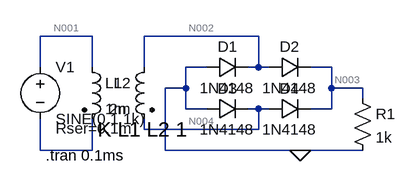
[diagram p0: schematic Draft6.asc]
Draft6.asc, the LTspice schematic file:
Version 4
SHEET 1 880 680
WIRE 0 32 -80 32
WIRE 256 32 80 32
WIRE -80 80 -80 32
WIRE 0 80 0 32
WIRE 80 80 80 32
WIRE 176 80 144 80
WIRE 256 80 256 32
WIRE 256 80 240 80
WIRE 272 80 256 80
WIRE 368 80 336 80
WIRE 144 112 144 80
WIRE 144 112 112 112
WIRE 368 112 368 80
WIRE 416 112 368 112
WIRE 416 128 416 112
WIRE 144 144 144 112
WIRE 176 144 144 144
WIRE 256 144 240 144
WIRE 272 144 256 144
WIRE 368 144 368 112
WIRE 368 144 336 144
WIRE 80 176 80 160
WIRE 256 176 256 144
WIRE 256 176 80 176
WIRE -80 208 -80 160
WIRE 0 208 0 160
WIRE 0 208 -80 208
WIRE 112 208 112 112
WIRE 320 208 112 208
WIRE 416 208 320 208
FLAG 320 208 0
SYMBOL diode 176 96 R270
WINDOW 0 32 32 VTop 2
WINDOW 3 0 32 VBottom 2
SYMATTR InstName D1
SYMATTR Value 1N4148
SYMBOL diode 272 96 R270
WINDOW 0 32 32 VTop 2
WINDOW 3 0 32 VBottom 2
SYMATTR InstName D2
SYMATTR Value 1N4148
SYMBOL diode 176 160 R270
WINDOW 0 32 32 VTop 2
WINDOW 3 0 32 VBottom 2
SYMATTR InstName D3
SYMATTR Value 1N4148
SYMBOL diode 272 160 R270
WINDOW 0 32 32 VTop 2
WINDOW 3 0 32 VBottom 2
SYMATTR InstName D4
SYMATTR Value 1N4148
SYMBOL res 400 112 R0
SYMATTR InstName R1
SYMATTR Value 1k
SYMBOL ind2 -16 64 R0
SYMATTR InstName L1
SYMATTR Value 1m
SYMATTR Type ind
SYMBOL ind2 96 64 M0
SYMATTR InstName L2
SYMATTR Value 2m
SYMATTR Type ind
SYMBOL voltage -80 64 R0
WINDOW 123 0 0 Left 0
WINDOW 39 24 110 Left 2
SYMATTR InstName V1
SYMATTR Value SINE(0 1 1k)
SYMATTR SpiceLine Rser=0.1m
TEXT 8 176 Left 3 !K L1 L2 1
TEXT -72 216 Left 2 !.tran 0.1ms

The netlist it stands for:
* Draft6.asc
D1 0 N002 1N4148
D2 N002 N003 1N4148
D3 0 N004 1N4148
D4 N004 N003 1N4148
R1 N003 0 1k
L1 N001 N005 1m
L2 N002 N004 2m
V1 N001 N005 SINE(0 1 1k) Rser=0.1m
.model D D
.lib standard.dio
K L1 L2 1
.tran 0.1ms
.backanno
.end

* Results of the author's LTspice run, read from the files saved beside the schematic
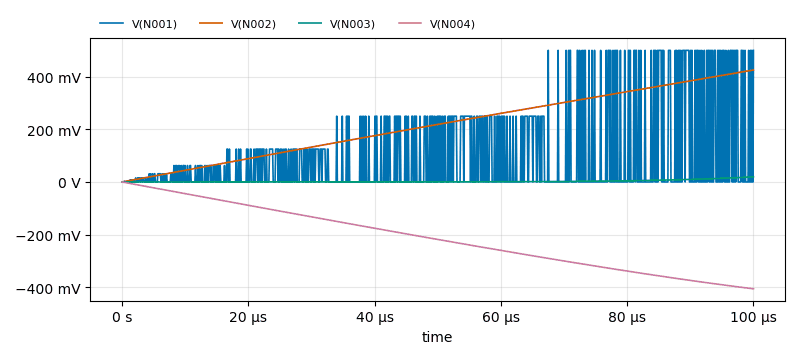
[diagram p1: Transient Analysis of Draft6.asc, plotted from the saved traces]
* Transient Analysis, 1 run:
*   V(N001): min -1.854 µV, max 500 mV, average 99.04 mV, rms 191.3 mV, last 500 mV
*   V(N002): min 0 V, max 425.4 mV, average 216.2 mV, rms 248.5 mV, last 425.4 mV
*   V(N003): min 0 V, max 19.56 mV, average 2.6 mV, rms 5.18 mV, last 19.56 mV
*   V(N004): min -405.8 mV, max 0 V, average -213.6 mV, rms 244.6 mV, last -405.8 mV